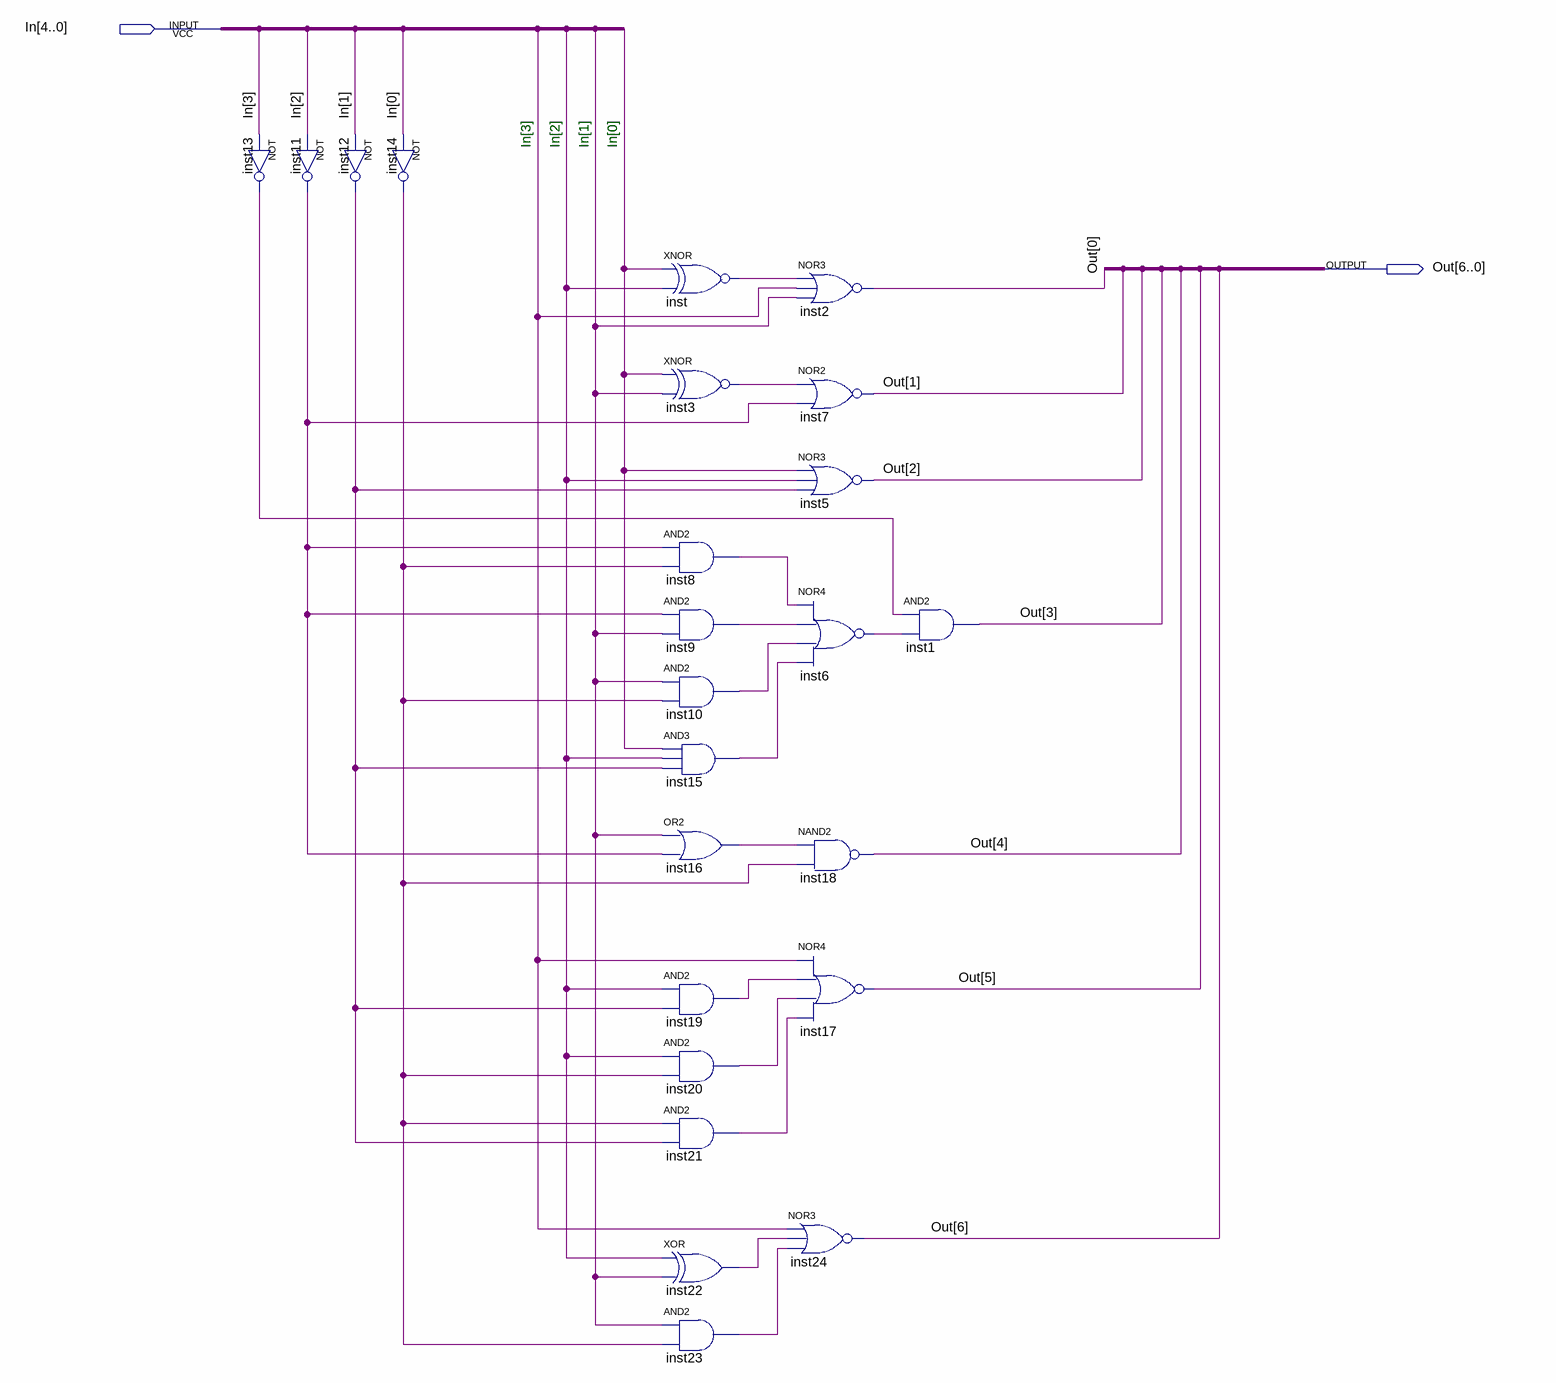
[diagram p0: schematic sheet]
// Quartus schematic bcd7.bdf as structural Verilog: 24 symbols, 2 pins
module bcd7 (
  input  [4:0] In,
  output [6:0] Out
);

  wire inst3_out, inst6_out, inst8_out, inst9_out, inst10_out, inst11_out, inst12_out, inst13_out,
       inst14_out, inst15_out, inst16_out, inst19_out, inst20_out, inst21_out, inst22_out, inst23_out,
       inst_out;

  not inst11 (inst11_out, In[2]);
  not inst13 (inst13_out, In[3]);
  not inst12 (inst12_out, In[1]);
  not inst14 (inst14_out, In[0]);
  xnor inst (inst_out, In[0], In[2]);
  xnor inst3 (inst3_out, In[0], In[1]);
  and inst8 (inst8_out, inst11_out, inst14_out);
  and inst9 (inst9_out, inst11_out, In[1]);
  and inst10 (inst10_out, In[1], inst14_out);
  and inst15 (inst15_out, In[0], In[2], inst12_out);
  or inst16 (inst16_out, In[1], inst11_out);
  and inst19 (inst19_out, In[2], inst12_out);
  and inst20 (inst20_out, In[2], inst14_out);
  and inst21 (inst21_out, inst14_out, inst12_out);
  xor inst22 (inst22_out, In[2], In[1]);
  and inst23 (inst23_out, In[1], inst14_out);
  nor inst2 (Out[0], inst_out, In[3], In[1]);
  nor inst7 (Out[1], inst3_out, inst11_out);
  nor inst5 (Out[2], In[0], In[2], inst12_out);
  nor inst6 (inst6_out, inst8_out, inst9_out, inst10_out, inst15_out);
  nand inst18 (Out[4], inst16_out, inst14_out);
  nor inst17 (Out[5], In[3], inst19_out, inst20_out, inst21_out);
  nor inst24 (Out[6], In[3], inst22_out, inst23_out);
  and inst1 (Out[3], inst13_out, inst6_out);

  // Notes on the sheet:
  //   In[3]
  //   In[2]
  //   In[1]
  //   In[0]
endmodule
